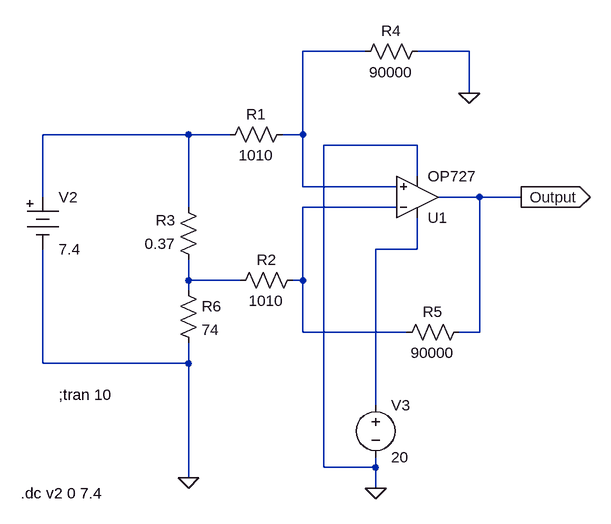
[diagram p0: schematic opamp_working.asc]
opamp_working.asc, the LTspice schematic file:
Version 4
SHEET 1 1176 680
WIRE 320 -144 224 -144
WIRE 480 -144 400 -144
WIRE 480 -80 480 -144
WIRE 48 -16 -176 -16
WIRE 112 -16 48 -16
WIRE 224 -16 224 -144
WIRE 224 -16 192 -16
WIRE 400 0 256 0
WIRE 400 48 400 0
WIRE 224 64 224 -16
WIRE 368 64 224 64
WIRE -176 80 -176 -16
WIRE 496 80 432 80
WIRE 560 80 496 80
WIRE 48 96 48 -16
WIRE 368 96 224 96
WIRE 400 160 400 112
WIRE 400 160 336 160
WIRE 48 208 48 176
WIRE 128 208 48 208
WIRE 224 208 224 96
WIRE 224 208 208 208
WIRE 48 224 48 208
WIRE 224 288 224 208
WIRE 384 288 224 288
WIRE 496 288 496 80
WIRE 496 288 464 288
WIRE -176 336 -176 160
WIRE 48 336 48 304
WIRE 48 336 -176 336
WIRE 336 400 336 160
WIRE 256 496 256 0
WIRE 336 496 336 480
WIRE 336 496 256 496
WIRE 48 512 48 336
WIRE 336 528 336 496
FLAG 480 -80 0
FLAG 48 512 0
FLAG 560 80 Output
IOPIN 560 80 Out
FLAG 336 528 0
SYMBOL OpAmps\\OP727 400 144 M180
SYMATTR InstName U1
SYMBOL res 208 -32 R90
WINDOW 0 0 56 VBottom 2
WINDOW 3 32 56 VTop 2
SYMATTR InstName R1
SYMATTR Value 1010
SYMBOL res 224 192 R90
WINDOW 0 0 56 VBottom 2
WINDOW 3 32 56 VTop 2
SYMATTR InstName R2
SYMATTR Value 1010
SYMBOL res 64 192 R180
WINDOW 0 36 76 Left 2
WINDOW 3 36 40 Left 2
SYMATTR InstName R3
SYMATTR Value 0.37
SYMATTR SpiceLine tol=1 pwr=0.1
SYMBOL res 304 -128 R270
WINDOW 0 32 56 VTop 2
WINDOW 3 0 56 VBottom 2
SYMATTR InstName R4
SYMATTR Value 90000
SYMBOL res 480 272 R90
WINDOW 0 0 56 VBottom 2
WINDOW 3 32 56 VTop 2
SYMATTR InstName R5
SYMATTR Value 90000
SYMBOL res 32 208 R0
SYMATTR InstName R6
SYMATTR Value 74
SYMBOL Misc\\battery -176 64 R0
WINDOW 123 0 0 Left 0
WINDOW 39 0 0 Left 0
SYMATTR InstName V2
SYMATTR Value 7.4
SYMBOL voltage 336 384 R0
WINDOW 123 0 0 Left 0
WINDOW 39 0 0 Left 0
SYMATTR InstName V3
SYMATTR Value 20
TEXT -152 384 Left 2 !;tran 10
TEXT -210 536 Left 2 !.dc v2 0 7.4

The netlist it stands for:
* opamp_working.asc
XU1 N001 N003 N004 0 Output OP727  ; pins In+ In- V+ V- OUT
R1 N001 N002 1010
R2 N003 N005 1010
R3 N005 N002 0.37 tol=1 pwr=0.1
R4 N001 0 90000
R5 Output N003 90000
R6 N005 0 74
V2 N002 0 7.4
V3 N004 0 20
;tran 10
.dc v2 0 7.4
.backanno
.end